# EAGLE design s3-pilot2 (EAGLE 7.3.0)
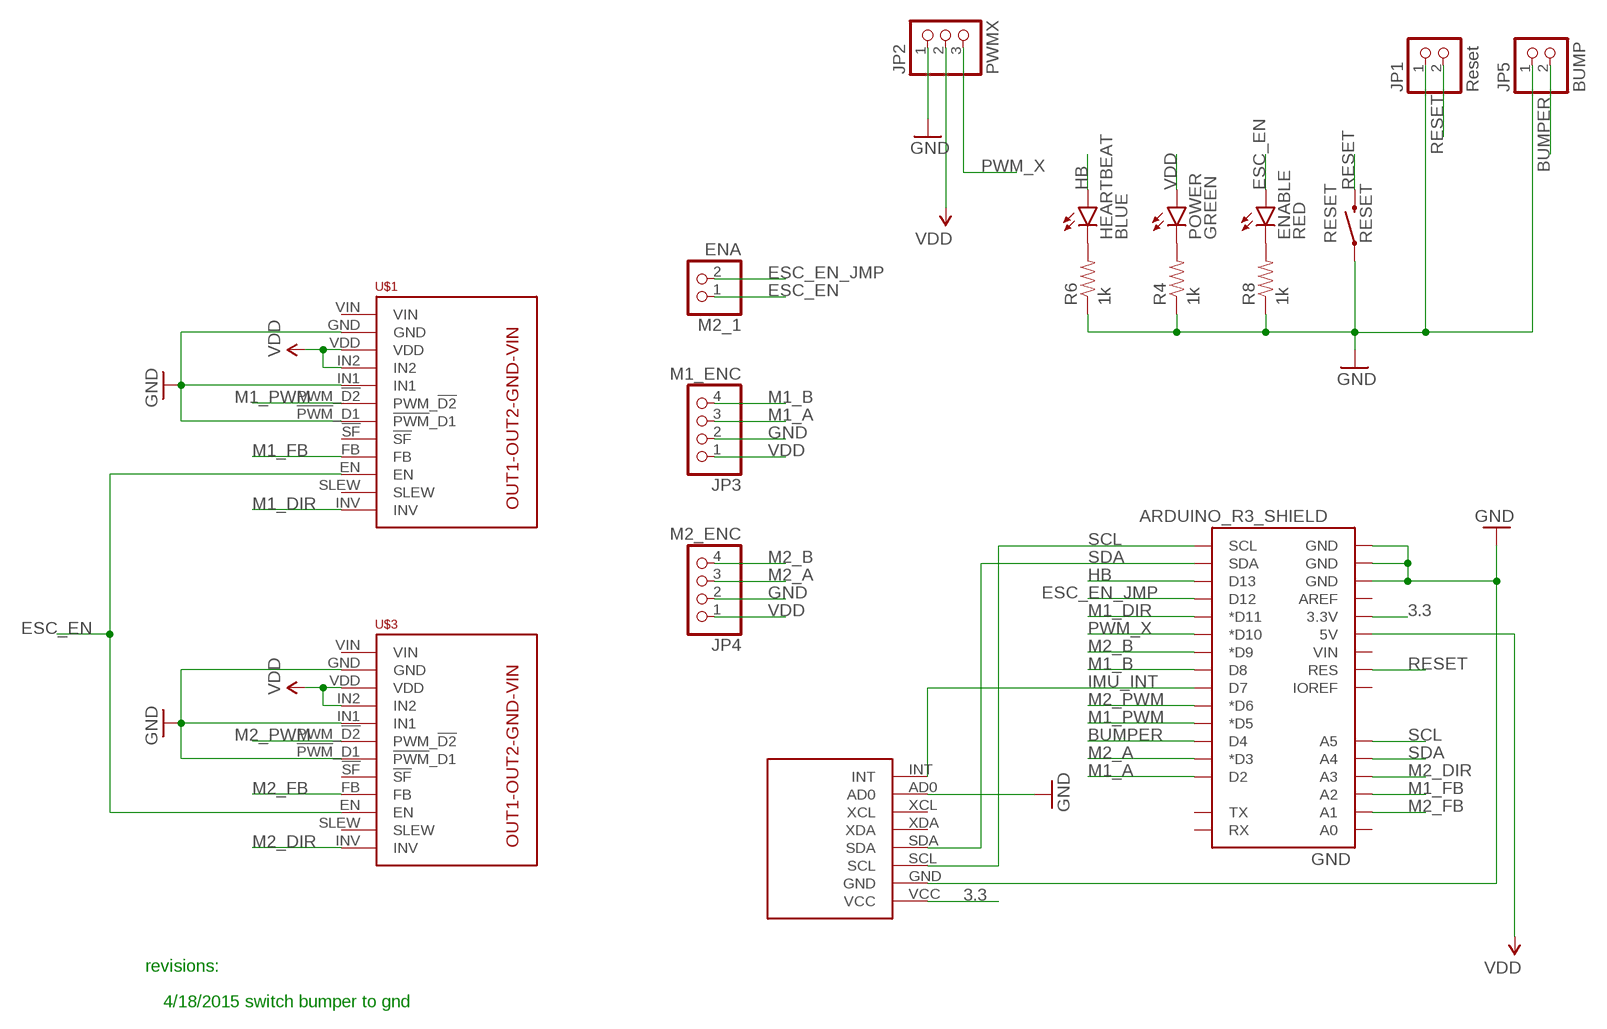
[diagram p0: schematic, sheet 1]

## Parts
ENABLE  RED  LED-RED1206  [LED-1206]
GND  ARDUINO_R3_SHIELD  [UNO_R3_SHIELD]
HEARTBEAT  BLUE  LED-BLUE1206  [LED-1206]
JP1  Reset  PINHD-1X2  [1X02]
JP2  PWMX  PINHD-1X3/90  [1X03/90]
JP3  M1_ENC  PINHD-1X4/90  [1X04/90]
JP4  M2_ENC  PINHD-1X4/90  [1X04/90]
JP5  BUMP  PINHD-1X2/90  [1X02/90]
M2_1  ENA  PINHD-1X2  [1X02]
MPU6050  MPU-6050-BO  [MPU-6050-BO]
POWER  GREEN  LED-GREENLARGE  [LED-1206]
R4  1k  RESISTOR1206  [1206]
R6  1k  RESISTOR1206  [1206]
R8  1k  RESISTOR1206  [1206]
RESET  RESET  SWITCH-MOMENTARY-2SMD-4  [TACTILE_SWITCH_TALL]
U$1  M1  MC33926-SINGLE-BO  [MC33926-SINGLE-BO]
U$3  M2  MC33926-SINGLE-BO  [MC33926-SINGLE-BO]

## Nets
3.3: GND.3.3V MPU6050.VCC
BUMPER: GND.D4 JP5.2
ESC_EN: ENABLE.A M2_1.1 U$1.EN U$3.EN
ESC_EN_JMP: GND.D12 M2_1.2
GND [Supply]: GND.GND@0(GND) GND.GND@1(GND) GND.GND@2(GND) JP1.1 JP2.1 JP3.2 JP4.2 JP5.1 MPU6050.AD0 MPU6050.GND R4.1 R6.1 R8.1 RESET.A2 U$1.!PWM!_D1 U$1.GND U$1.IN1 U$3.!PWM!_D1 U$3.GND U$3.IN1
HB: GND.D13 HEARTBEAT.A
IMU_INT: GND.D7 MPU6050.INT
M1_A: GND.D2 JP3.3
M1_B: GND.D8 JP3.4
M1_DIR: GND.D11(*D11) U$1.INV
M1_FB: GND.A2 U$1.FB
M1_PWM: GND.D5(*D5) U$1.PWM_!D2
M2_A: GND.D3(*D3) JP4.3
M2_B: GND.D9(*D9) JP4.4
M2_DIR: GND.A3 U$3.INV
M2_FB: GND.A1 U$3.FB
M2_PWM: GND.D6(*D6) U$3.PWM_!D2
N$21: POWER.C R4.2
N$23: ENABLE.C R8.2
N$24: HEARTBEAT.C R6.2
PWM_X: GND.D10(*D10) JP2.3
RESET: GND.RES JP1.2 RESET.B2
SCL: GND.A5 GND.SCL MPU6050.SCL
SDA: GND.A4 GND.SDA MPU6050.SDA
VDD [Supply]: GND.5V JP2.2 JP3.1 JP4.1 POWER.A U$1.IN2 U$1.VDD U$3.IN2 U$3.VDD
Unconnected: GND.A0 GND.AREF GND.IOREF GND.RX GND.TX GND.VIN MPU6050.XCL MPU6050.XDA U$1.!SF U$1.SLEW U$1.VIN U$3.!SF U$3.SLEW U$3.VIN

## Notes on the sheet
- revisions:
- 4/18/2015 switch bumper to gnd

## Library data of the parts
ENABLE = SparkFun-LED:LED-RED: Assorted Red LEDs LilyPad 1206- DIO-09912 1206- DIO-00809 0603- DIO-00819; PROD_ID: DIO-00809
GND = SparkFun-Boards:ARDUINO_R3_SHIELD: Shield form compatible with the Arduino Uno R3.
HEARTBEAT = SparkFun-LED:LED-BLUE: Blue LEDs for production use Various blue LEDs stocked by SparkFun production 0603 - DIO-08575 Rebel - DIO-09553 1206 - DIO-09911; PROD_ID: DIO-09911
JP1 JP5 M2_1 = pinhead:PINHD-1X2: PIN HEADER
JP2 = pinhead:PINHD-1X3: PIN HEADER
JP3 JP4 = pinhead:PINHD-1X4: PIN HEADER
MPU6050 = s3-pilot2-lbr:MPU-6050-BO
POWER = SparkFun-LED:LED-GREEN: Various green LEDs Green LEDs used in SFE Production 0603- DIO-00821 LARGE- DIO-00862 LILYPAD- DIO-09910; PROD_ID: DIO-00862
R4 R6 R8 = SparkFun-Passives:RESISTOR: Resistor Basic schematic elements and footprints for 0603, 1206, and PTH resistors.
RESET = SparkFun-Electromechanical:SWITCH-MOMENTARY-2: Various NO switches- pushbuttons, reed, etc; PROD_ID: SWCH-11966
U$1 U$3 = s3-pilot2-lbr:MC33926-SINGLE-BO

## Net classes
1 Supply: width 0.508 mm

## Board
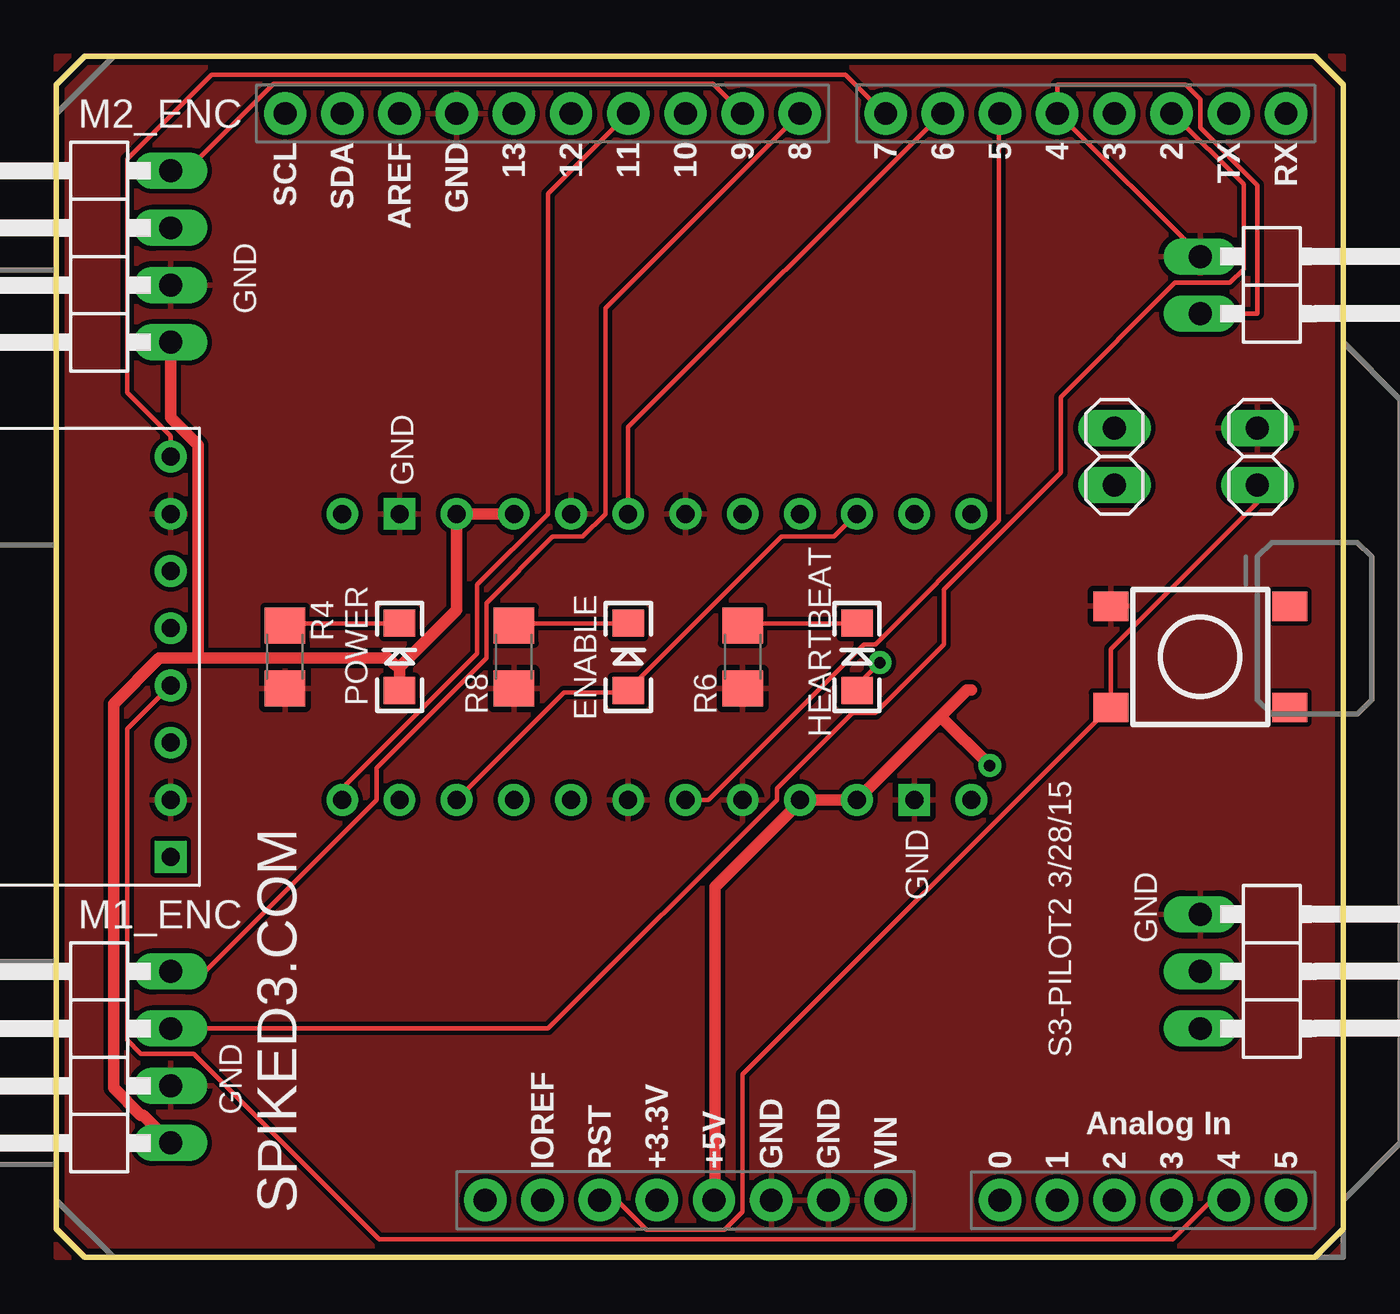
[diagram p1: board, top side]
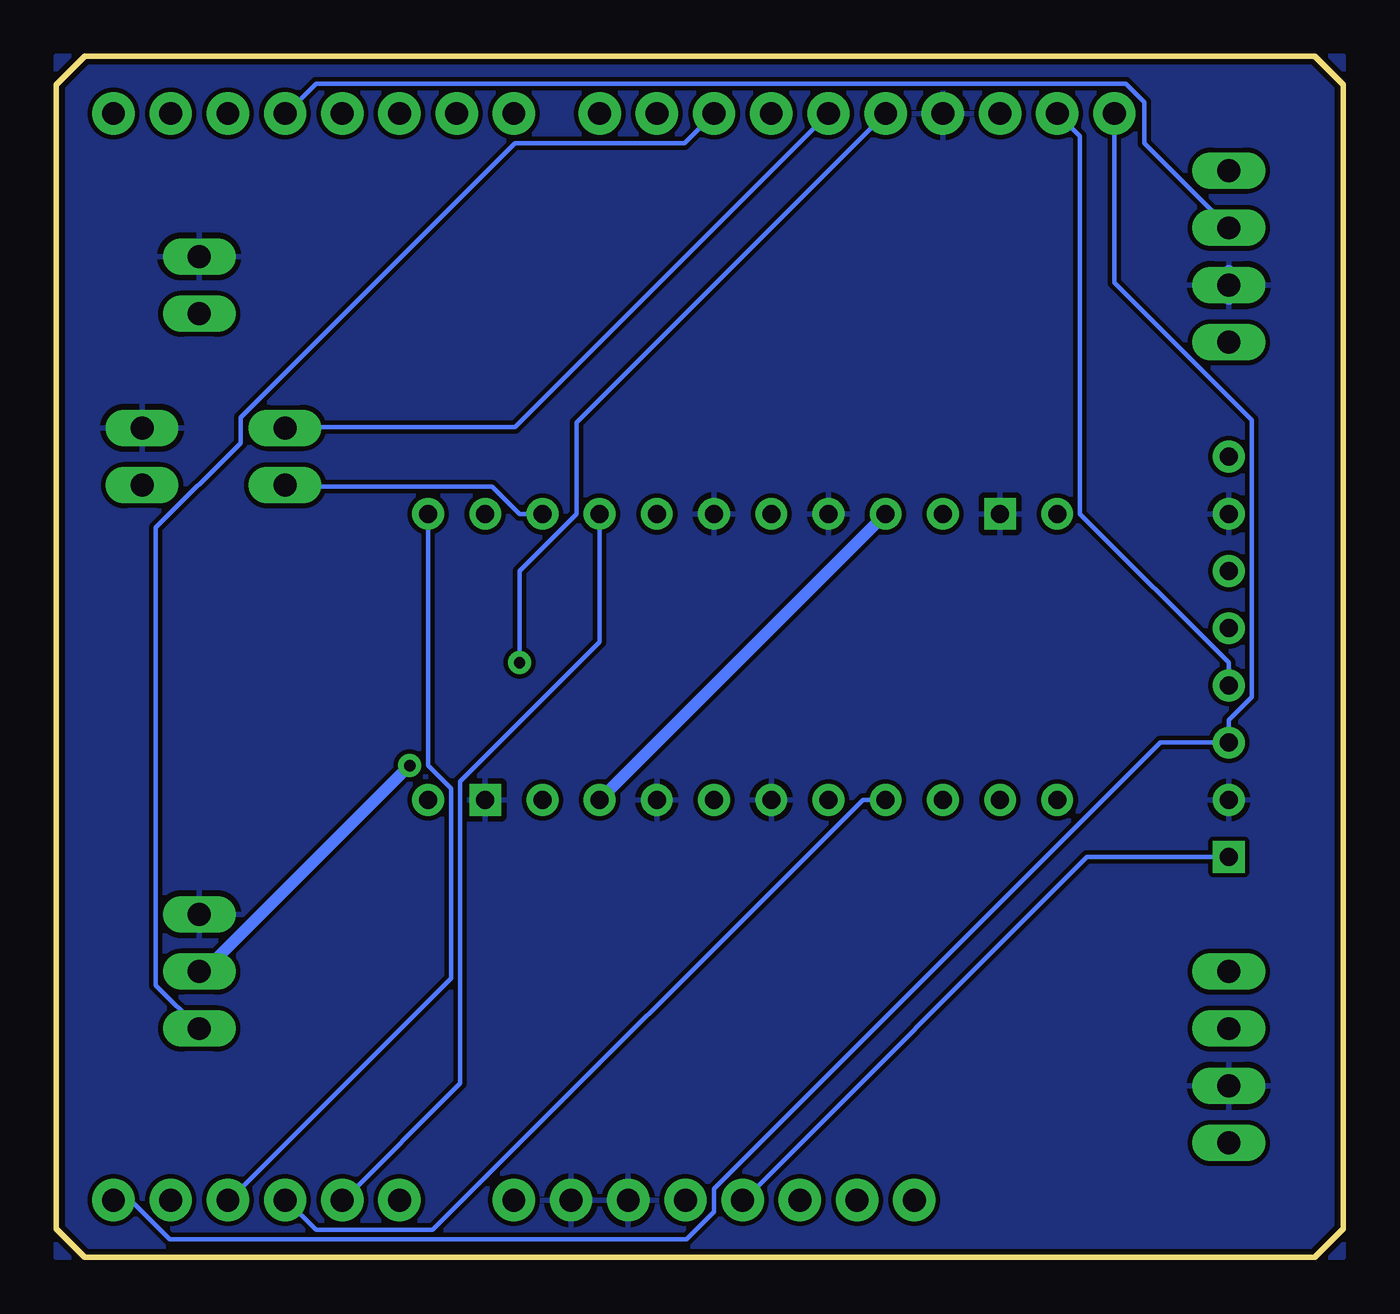
[diagram p2: board, bottom side, seen from below]

Size 57.15 x 53.34 mm. Coordinates in mm from the lower left corner, seen from the top.
Outline: 0,1.27 0,52.07 1.27,53.34 55.88,53.34 57.15,52.07 57.15,1.27 55.88,0 1.27,0 0,1.27
Copper layers (1*16): Top 0.035mm / dielectric 1.5mm / Bottom 0.035mm
Design rules "SparkFun": minimum track width 8mil, minimum drill 20mil, track to track 8mil, track to pad 8mil, pad to pad 8mil, via to via 8mil, smd to smd 8mil, copper to edge 10mil, drill to drill 8mil, minimum pad ring 12mil, minimum via ring 10mil, stop-mask expansion 4mil, vias tented up to drill 25mil, thermal gap 10mil

### Footprints (pad centres in the part's own frame; a part is rotated, then mirrored left to right if it is on the bottom)
LED-1206 = smd 1.2 x 1.4: A -1.5,0; C 1.5,0
UNO_R3_SHIELD = drill 1.016 pad 1.88: 3.3V 50.8,26.67; 5V 50.8,29.21; A0 50.8,41.91; A1 50.8,44.45; A2 50.8,46.99; A3 50.8,49.53; A4 50.8,52.07; A5 50.8,54.61; AREF 2.54,15.24; D2 2.54,49.53; D3 2.54,46.99; D4 2.54,44.45; D5 2.54,41.91; D6 2.54,39.37; D7 2.54,36.83; D8 2.54,33.02; D9 2.54,30.48; D10 2.54,27.94; D11 2.54,25.4; D12 2.54,22.86; D13 2.54,20.32; GND@0 50.8,31.75; GND@1 50.8,34.29; GND@2 2.54,17.78; IOREF 50.8,21.59; NC 50.8,19.05; RES 50.8,24.13; RX 2.54,54.61; SCL 2.54,10.16; SDA 2.54,12.7; TX 2.54,52.07; VIN 50.8,36.83
1X02 = drill 1.016 long: 1 -1.27,0; 2 1.27,0
1X03/90 = drill 1.016 long: 1 -2.54,-3.81; 2 0,-3.81; 3 2.54,-3.81
1X04/90 = drill 1.016 long: 1 -3.81,-3.81; 2 -1.27,-3.81; 3 1.27,-3.81; 4 3.81,-3.81
1X02/90 = drill 1.016 long: 1 -1.27,-3.81; 2 1.27,-3.81
MPU-6050-BO = drill 0.8: AD0 1.27,3.81; GND 1.27,16.51; INT 1.27,1.27; SCL 1.27,13.97; SDA 1.27,11.43; XCL 1.27,6.35; XDA 1.27,8.89 | drill 0.8 square: VCC 1.27,19.05
1206 = smd 1.6 x 1.8: 1 -1.4,0; 2 1.4,0
TACTILE_SWITCH_TALL = smd 1.55 x 1.3: A1 -3.975,-2.25; A2 3.975,-2.25; B1 -3.975,2.25; B2 3.975,2.25
MC33926-SINGLE-BO = drill 0.8: !PWM!_D1 -5.08,-8.89; !SF -5.08,-11.43; EN -5.08,-16.51; FB -5.08,-13.97; IN1 -5.08,-3.81; IN2 -5.08,-1.27; INV -5.08,-21.59; PWM_!D2 -5.08,-6.35; SLEW -5.08,-19.05; VDD -5.08,1.27; VIN -5.08,6.35 | drill 0.8 square: GND -5.08,3.81

### Placement (x,y rotation side)
ENABLE  25.4,26.67 90 top
GND  0,53.34 270 top
HEARTBEAT  35.56,26.67 90 top
JP1  53.34,35.56 270 top
JP2  54.61,12.7 270 top
JP3  1.27,8.89 90 top
JP4  1.27,44.45 90 top
JP5  54.61,43.18 270 top
M2_1  46.99,35.56 90 top
MPU6050  6.35,36.83 180 top
POWER  15.24,26.67 90 top
R4  10.16,26.67 90 top
R6  30.48,26.67 90 top
R8  20.32,26.67 90 top
RESET  50.8,26.67 180 top
U$1  34.29,15.24 270 top
U$3  19.05,38.1 90 top

### Tracks (layer width: path | path; a pad name or v marks a point on that pad's centre or on a via)
3.3
  Bottom 0.203: MPU6050.VCC 11.38,17.78 26.62,2.54 GND.3.3V
BUMPER
  Top 0.203: 50.8,44.5 44.5,50.8 GND.D4 44.45,52.07 50.16,52.07 50.8,51.44 50.8,50.16 53.34,47.62 53.34,41.91 JP5.2
ESC_EN
  Top 0.203: U$1.EN 22.55,25.09 25.4,25.09 ENABLE.A 25.4,25.2 32.21,32 34.54,32 U$3.EN
  Bottom 0.203: U$3.EN 36.58,33.02 37.8,34.24 46.94,34.24 M2_1.1
ESC_EN_JMP
  Bottom 0.203: GND.D12 36.78,36.88 46.94,36.88 M2_1.2
GND
  Top 0.508: GND.GND@1 34.16,2.54 | 31.9,2.44 GND.GND@0
  Bottom 0.508: GND.GND@1 34.16,2.54 | 31.9,2.44 GND.GND@0 | 5.08,42.55 JP4.2 5.08,43.82
  pour Bottom: 0,53.34 0,0 57.15,0 57.15,53.34
  pour Top: 0,53.34 0,0 57.15,0 57.15,53.34
HB  (via drill 0.51)
  Top 0.203: HEARTBEAT.A 35.56,25.4 v36.58,26.42
  Bottom 0.203: v36.58,26.42 36.58,30.48 34.04,33.02 34.04,37.08 GND.D13
IMU_INT
  Top 0.203: MPU6050.INT 5.08,36.47 3.15,38.41 3.15,48.77 6.91,52.53 35.05,52.53 36.78,50.8 GND.D7
M1_A
  Top 0.203: JP3.3 21.84,10.16 32,20.32 32,20.83 35.36,24.18 36.37,24.18 39.42,27.23 39.42,29.67 44.6,34.85 44.6,38.2 49.68,43.28 52.12,43.28 52.73,43.89 52.73,47.65 49.58,50.8 GND.D2
M1_B
  Top 0.203: JP3.4 6.6,12.7 14.22,20.32 14.22,21.74 19.1,26.62 19.1,29.06 22.05,32 23.37,32 24.38,33.02 24.38,42.16 GND.D8
M1_DIR
  Top 0.203: U$1.INV 12.7,20.83 18.69,26.82 18.69,29.87 21.84,33.02 21.84,47.24 GND.D11
M1_FB
  Bottom 0.203: U$1.FB 21.34,20.32 40.44,1.22 45.62,1.22 46.94,2.54 GND.A2
M1_PWM
  Top 0.203: U$1.PWM_!D2 28.96,20.32 35.87,27.23 36.37,27.23 41.86,32.72 41.86,50.8 GND.D5
M2_A
  Bottom 0.203: JP4.3 8.84,49.48 8.84,51.31 9.65,52.12 45.62,52.12 46.94,50.8 GND.D3
M2_B
  Top 0.203: JP4.4 5.79,48.26 9.65,52.12 29.16,52.12 GND.D9
M2_DIR
  Bottom 0.203: U$3.INV 40.64,21.84 39.62,20.83 39.62,12.4 49.48,2.54 GND.A3
M2_FB
  Bottom 0.203: U$3.FB 33.02,27.33 39.22,21.13 39.22,7.72 44.4,2.54 GND.A1
M2_PWM
  Top 0.203: U$3.PWM_!D2 25.4,36.88 39.32,50.8 GND.D6
N$21
  Top 0.203: POWER.C 15.24,28.14 10.16,28.14 R4.2
N$23
  Top 0.203: ENABLE.C 25.4,28.14 20.32,28.14 R8.2
N$24
  Top 0.203: HEARTBEAT.C 35.56,28.14 30.48,28.14 R6.2
PWM_X
  Bottom 0.203: JP2.3 52.73,12.09 52.73,32.41 48.97,36.17 48.97,37.29 36.78,49.48 29.26,49.48 GND.D10
RESET
  Top 0.203: JP1.2 53.34,33.53 46.84,27.03 46.84,24.49 RESET.B2 46.74,24.38 30.48,8.13 30.48,2.03 29.67,1.22 26.21,1.22 24.89,2.54 GND.RES
SCL
  Bottom 0.203: GND.SCL 10.16,43.28 4.06,37.19 4.06,24.89 5.08,23.88 MPU6050.SCL 8.13,22.86 27.94,3.05 27.94,2.03 29.16,0.81 52.12,0.81 53.85,2.54 GND.A5
SDA
  Top 0.203: GND.A4 51.31,2.54 49.58,0.81 14.33,0.81 6.1,9.04 3.76,9.04 3.15,9.65 3.15,23.47 MPU6050.SDA
  Bottom 0.203: MPU6050.SDA 5.08,26.42 11.68,33.02 11.68,49.78 GND.SDA
VDD  (via drill 0.51)
  Top 0.508: 40.64,25.2 40.44,25.2 39.27,24.03 | 39.27,24.03 U$1.VDD U$1.IN2 32.92,20.12 29.26,16.46 29.26,2.54 GND.5V | 39.27,24.03 v41.45,21.84 | 15.24,26.21 POWER.A | 15.24,26.21 17.78,28.75 U$3.VDD U$3.IN2 | JP3.1 3.86,6.3 3.76,6.3 2.54,7.52 2.54,24.59 4.57,26.62 6.3,26.62 | 6.3,26.62 14.73,26.62 15.04,26.31 15.24,26.21 | JP4.1 5.08,37.29 6.3,36.07 6.3,26.62
  Bottom 0.508: JP2.2 50.6,12.7 v41.45,21.84 | U$3.IN2 U$1.IN2

### Text on the board
tPlace: GND | GND | SPIKED3.COM | GND | GND | S3-PILOT2 3/28/15 | GND